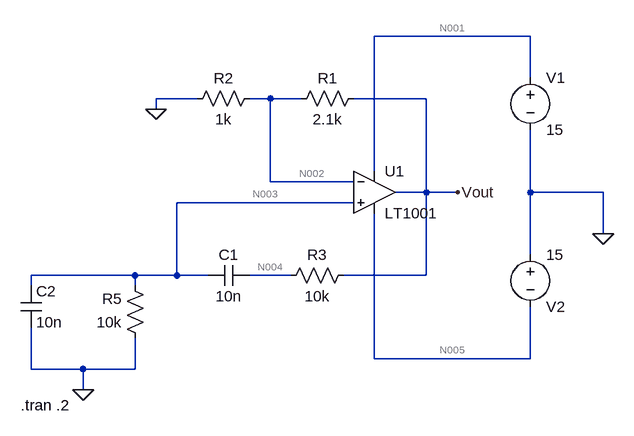
[diagram p0: schematic Wein_bridge_opamp_LTspice.asc]
Wein_bridge_opamp_LTspice.asc, the LTspice schematic file:
Version 4
SHEET 1 880 680
WIRE 512 -64 272 -64
WIRE 512 0 512 -64
WIRE 0 32 -64 32
WIRE 112 32 80 32
WIRE 160 32 112 32
WIRE 352 32 240 32
WIRE -64 48 -64 32
WIRE 272 144 272 -64
WIRE 112 160 112 32
WIRE 240 160 112 160
WIRE 352 176 352 32
WIRE 352 176 304 176
WIRE 400 176 352 176
WIRE 512 176 512 80
WIRE 624 176 512 176
WIRE 240 192 -32 192
WIRE 624 240 624 176
WIRE 512 272 512 176
WIRE -96 304 -256 304
WIRE -32 304 -32 192
WIRE -32 304 -96 304
WIRE 16 304 -32 304
WIRE 144 304 80 304
WIRE 352 304 352 176
WIRE 352 304 224 304
WIRE -256 320 -256 304
WIRE -96 320 -96 304
WIRE 272 432 272 208
WIRE 512 432 512 352
WIRE 512 432 272 432
WIRE -256 448 -256 384
WIRE -176 448 -256 448
WIRE -96 448 -96 400
WIRE -96 448 -176 448
WIRE -176 480 -176 448
FLAG 624 240 0
FLAG 400 176 Vout
FLAG -64 48 0
FLAG -176 480 0
SYMBOL OpAmps\\LT1001 272 112 R0
SYMATTR InstName U1
SYMBOL voltage 512 -16 R0
WINDOW 123 0 0 Left 0
WINDOW 39 0 0 Left 0
SYMATTR InstName V1
SYMATTR Value 15
SYMBOL voltage 512 256 R0
WINDOW 0 24 96 Left 2
WINDOW 3 24 16 Left 2
WINDOW 123 0 0 Left 0
WINDOW 39 0 0 Left 0
SYMATTR InstName V2
SYMATTR Value 15
SYMBOL res 256 16 R90
WINDOW 0 0 56 VBottom 2
WINDOW 3 32 56 VTop 2
SYMATTR InstName R1
SYMATTR Value 2.1k
SYMBOL res 96 16 R90
WINDOW 0 0 56 VBottom 2
WINDOW 3 32 56 VTop 2
SYMATTR InstName R2
SYMATTR Value 1k
SYMBOL res 240 288 R90
WINDOW 0 0 56 VBottom 2
WINDOW 3 32 56 VTop 2
SYMATTR InstName R3
SYMATTR Value 10k
SYMBOL cap 80 288 R90
WINDOW 0 0 32 VBottom 2
WINDOW 3 32 32 VTop 2
SYMATTR InstName C1
SYMATTR Value 10n
SYMBOL res -80 416 R180
WINDOW 0 36 76 Left 2
WINDOW 3 36 40 Left 2
SYMATTR InstName R5
SYMATTR Value 10k
SYMBOL cap -272 320 R0
SYMATTR InstName C2
SYMATTR Value 10n
TEXT -272 504 Left 2 !.tran .2

The netlist it stands for:
* Wein_bridge_opamp_LTspice.asc
XU1 N003 N002 N001 N005 Vout LT1001  ; pins In+ In- V+ V- OUT
V1 N001 0 15
V2 0 N005 15
R1 Vout N002 2.1k
R2 N002 0 1k
R3 Vout N004 10k
C1 N004 N003 10n
R5 0 N003 10k
C2 N003 0 10n
.tran .2
.lib LTC.lib
.backanno
.end

* Results of the author's LTspice run, read from the files saved beside the schematic
* Operating Point, zero values left out:
*   V(n001) = 15 V
*   V(n005) = -15 V
*   I(V1) = -2.25 mA
*   I(V2) = -2.25 mA
*   Ix(u1:3) = 2.25 mA
*   Ix(u1:4) = -2.25 mA
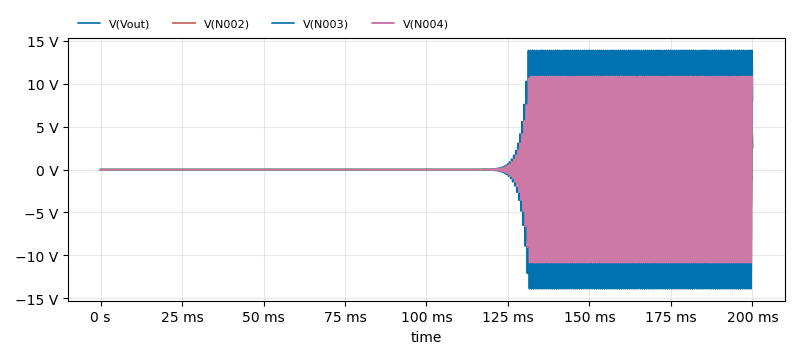
[diagram p1: Transient Analysis of Wein_bridge_opamp_LTspice.asc, plotted from the saved traces]
* Transient Analysis, 1 run:
*   V(Vout): min -13.9 V, max 13.9 V, average 6.737 mV, rms 6.234 V, last 7.975 V
*   V(N002): min -4.483 V, max 4.483 V, average 2.173 mV, rms 2.011 V, last 2.573 V
*   V(N003): min -4.917 V, max 4.917 V, average 2.221 mV, rms 2.073 V, last 2.547 V
*   V(N004): min -10.88 V, max 10.88 V, average 3.257 mV, rms 4.626 V, last 9.432 V